# EAGLE design astable (EAGLE 8.3.1)
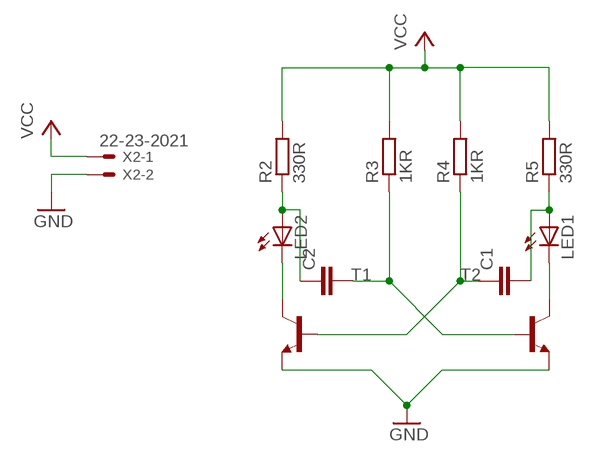
[diagram p0: schematic, sheet 1]

## Parts
C1  C-EU025-030X050  [C025-030X050]
C2  C-EU025-030X050  [C025-030X050]
LED1  LED5MM  [LED5MM]
LED2  LED5MM  [LED5MM]
R2  330R  R-EU_0207/10  [0207/10]
R3  1KR  R-EU_0207/10  [0207/10]
R4  1KR  R-EU_0207/10  [0207/10]
R5  330R  R-EU_0207/10  [0207/10]
T1  -NPN-TO92-E1  [TO92-E1]
T2  -NPN-TO92-E1  [TO92-E1]
X2  22-23-2021  [22-23-2021]

## Nets
GND: T1.3(E) T2.3(E) X2.2
N$1: C2.2 R3.1 T2.2(B)
N$2: C1.1 R4.1 T1.2(B)
N$3: C2.1 LED2.A R2.1
N$4: LED2.K(C) T1.1(C)
N$5: LED1.K(C) T2.1(C)
N$6: C1.2 LED1.A R5.1
VCC: R2.2 R3.2 R4.2 R5.2 X2.1

## Library data of the parts
C1 C2 = rcl:C-EU: CAPACITOR, European symbol
LED1 LED2 = led:LED: LED OSRAM: - CHIPLED LG R971, LG N971, LY N971, LG Q971, LY Q971, LO R971, LY R971 LH N974, LH R974 LS Q976, LO Q976, LY Q976 LO Q996 - Hyper CHIPLED LW Q18S LB Q993, LB Q99A, LB R99A - SideLED LS A670, LO A670, LY A670, LG A670, LP A670 LB A673, LV A673, LT A673, LW A673 LH A674 LY A675 LS A676, LA A676, LO A676, LY A676, LW A676 LS A679, LY A679, LG A679 - Hyper Micro SIDELED® LS Y876, LA Y876, LO Y876, LY Y876 LT Y87S - SmartLED LW L88C, LW L88S LB L89C, LB L89S, LG L890 LS L89K, LO L89K, LY L89K LS L896, LA L896, LO L896, LY L896 - TOPLED LS T670, LO T670, LY T670, LG T670, LP T670 LSG T670, LSP T670, LSY T670, LOP T670, LYG T670 LG T671, LOG T671, LSG T671 LB T673, LV T673, LT T673, LW T673 LH T674 LS T676, LA T676, LO T676, LY T676, LB T676, LH T676, LSB T676, LW T676 LB T67C, LV T67C, LT T67C, LS T67K, LO T67K, LY T67K, LW E67C LS E67B, LA E67B, LO E67B, LY E67B, LB E67C, LV E67C, LT E67C LW T67C LS T679, LY T679, LG T679 LS T770, LO T770, LY T770, LG T770, LP T770 LB T773, LV T773, LT T773, LW T773 LH T774 LS E675, LA E675, LY E675, LS T675 LS T776, LA T776, LO T776, LY T776, LB T776 LHGB T686 LT T68C, LB T68C - Hyper Mini TOPLED® LB M676 - Mini TOPLED Santana® LG M470 LS M47K, LO M47K, LY M47K Source: http://www.osram.convergy.de LUXEON: - LUMILED® LXK2-PW12-R00, LXK2-PW12-S00, LXK2-PW14-U00, LXK2-PW14-V00 LXK2-PM12-R00, LXK2-PM12-S00, LXK2-PM14-U00 LXK2-PE12-Q00, LXK2-PE12-R00, LXK2-PE12-S00, LXK2-PE14-T00, LXK2-PE14-U00 LXK2-PB12-K00, LXK2-PB12-L00, LXK2-PB12-M00, LXK2-PB14-N00, LXK2-PB14-P00, LXK2-PB14-Q00 LXK2-PR12-L00, LXK2-PR12-M00, LXK2-PR14-Q00, LXK2-PR14-R00 LXK2-PD12-Q00, LXK2-PD12-R00, LXK2-PD12-S00 LXK2-PH12-R00, LXK2-PH12-S00 LXK2-PL12-P00, LXK2-PL12-Q00, LXK2-PL12-R00 Source: www.luxeon.com KINGBRIGHT: KA-3528ASYC Source: www.kingbright.com
R2-R5 = rcl:R-EU_: RESISTOR, European symbol
T1 T2 = transistor:*-NPN-: NPN Transistror BF959 corrected 2008.03.06
X2 = con-molex:22-23-2021: .100" (2.54mm) Center Header - 2 Pin; MF: MOLEX; MPN: 22-23-2021; OC_FARNELL: 1462926; OC_NEWARK: 25C3832

## Board
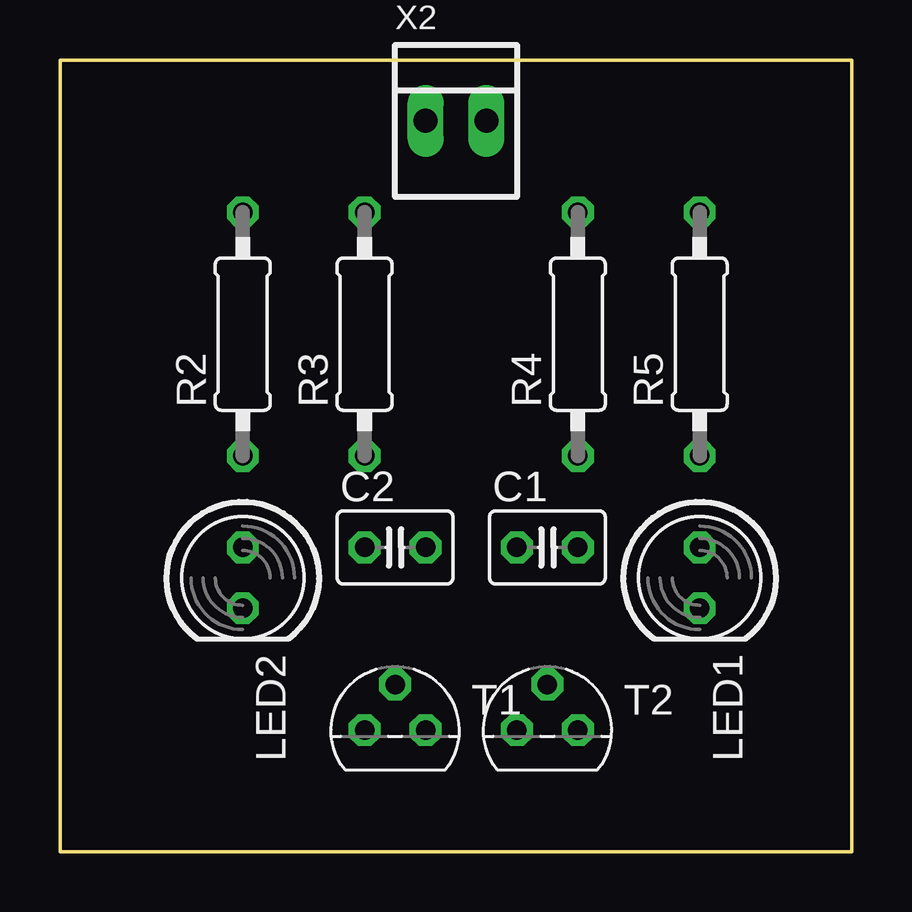
[diagram p1: board, top side]
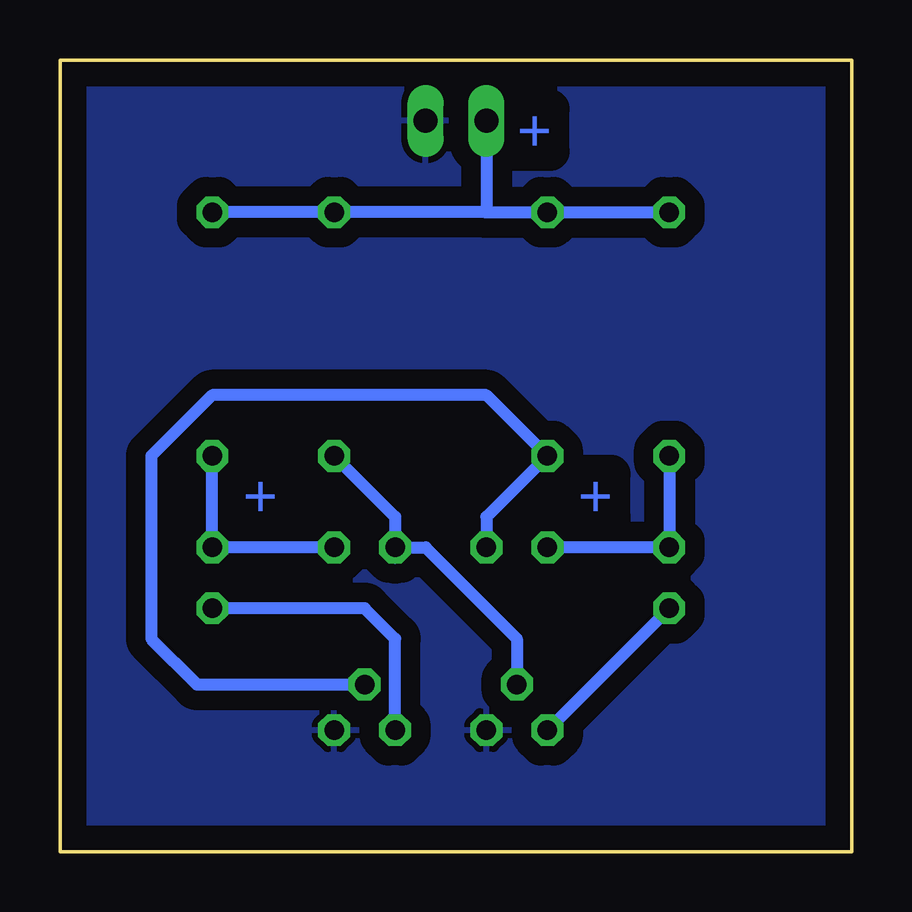
[diagram p2: board, bottom side, seen from below]

Size 33.02 x 33.02 mm. Coordinates in mm from the lower left corner, seen from the top.
Outline: 0,33.02 33.02,33.02 33.02,0 0,0 0,33.02
Copper layers (1*16): Top 0.035mm / dielectric 1.5mm / Bottom 0.035mm
Design rules "default": minimum track width 6mil, minimum drill 0.35mm, track to track 6mil, track to pad 6mil, pad to pad 6mil, via to via 6mil, smd to smd 6mil, copper to edge 40mil, drill to drill 6mil, minimum pad ring 10mil, minimum via ring 8mil, stop-mask expansion 4mil, vias tented up to drill 0mil, thermal gap 10mil

### Footprints (pad centres in the part's own frame; a part is rotated, then mirrored left to right if it is on the bottom)
C025-030X050 = drill 0.813 octagon: 1 -1.27,0; 2 1.27,0
LED5MM = drill 0.813 octagon: A -1.27,0; K 1.27,0
0207/10 = drill 0.813 octagon: 1 -5.08,0; 2 5.08,0
TO92-E1 = drill 0.813 octagon: 1 -1.27,0; 2 0,1.905; 3 1.27,0
22-23-2021 = drill 1 long: 1 -1.27,0; 2 1.27,0

### Placement (x,y rotation side)
C1  20.32,12.7 0 top
C2  13.97,12.7 0 top
LED1  26.67,11.43 270 top
LED2  7.62,11.43 270 top
R2  7.62,21.59 90 top
R3  12.7,21.59 90 top
R4  21.59,21.59 90 top
R5  26.67,21.59 90 top
T1  13.97,5.08 0 top
T2  20.32,5.08 0 top
X2  16.51,30.48 0 top

### Tracks (layer width: path | path; a pad name or v marks a point on that pad's centre or on a via)
GND
  pour Bottom (isolate 0.813): 33.02,33.02 0,33.02 0,0 33.02,0
N$1
  Bottom 0.508: C2.2 15.24,13.97 R3.1 15.24,19.05 26.67,19.05 29.21,16.51 29.21,8.89 27.3,6.98 T2.2
N$2
  Bottom 0.152: C1.1 19.05,12.62 19.05,12.07
  Bottom 0.508: R4.1 19.05,13.97 19.05,12.62 | C1.1 17.78,12.7 13.97,8.89 T1.2
N$3
  Bottom 0.508: R2.1 LED2.A C2.1
N$4
  Bottom 0.508: LED2.K T1.1
N$5
  Bottom 0.508: T2.1 19.05,8.89 20.32,10.16 LED1.K
N$6
  Bottom 0.508: R5.1 LED1.A C1.2
VCC
  Bottom 0.152: 12.52,26.67 R3.2 | 15.24,26.73 15.3,26.67
  Bottom 0.508: R2.2 12.52,26.67 15.3,26.67 R4.2 R5.2 | X2.1 15.24,26.73

### Text on the board
Bottom: + | + | +